# EAGLE design Sonar_2012_V9 (EAGLE 6.1)
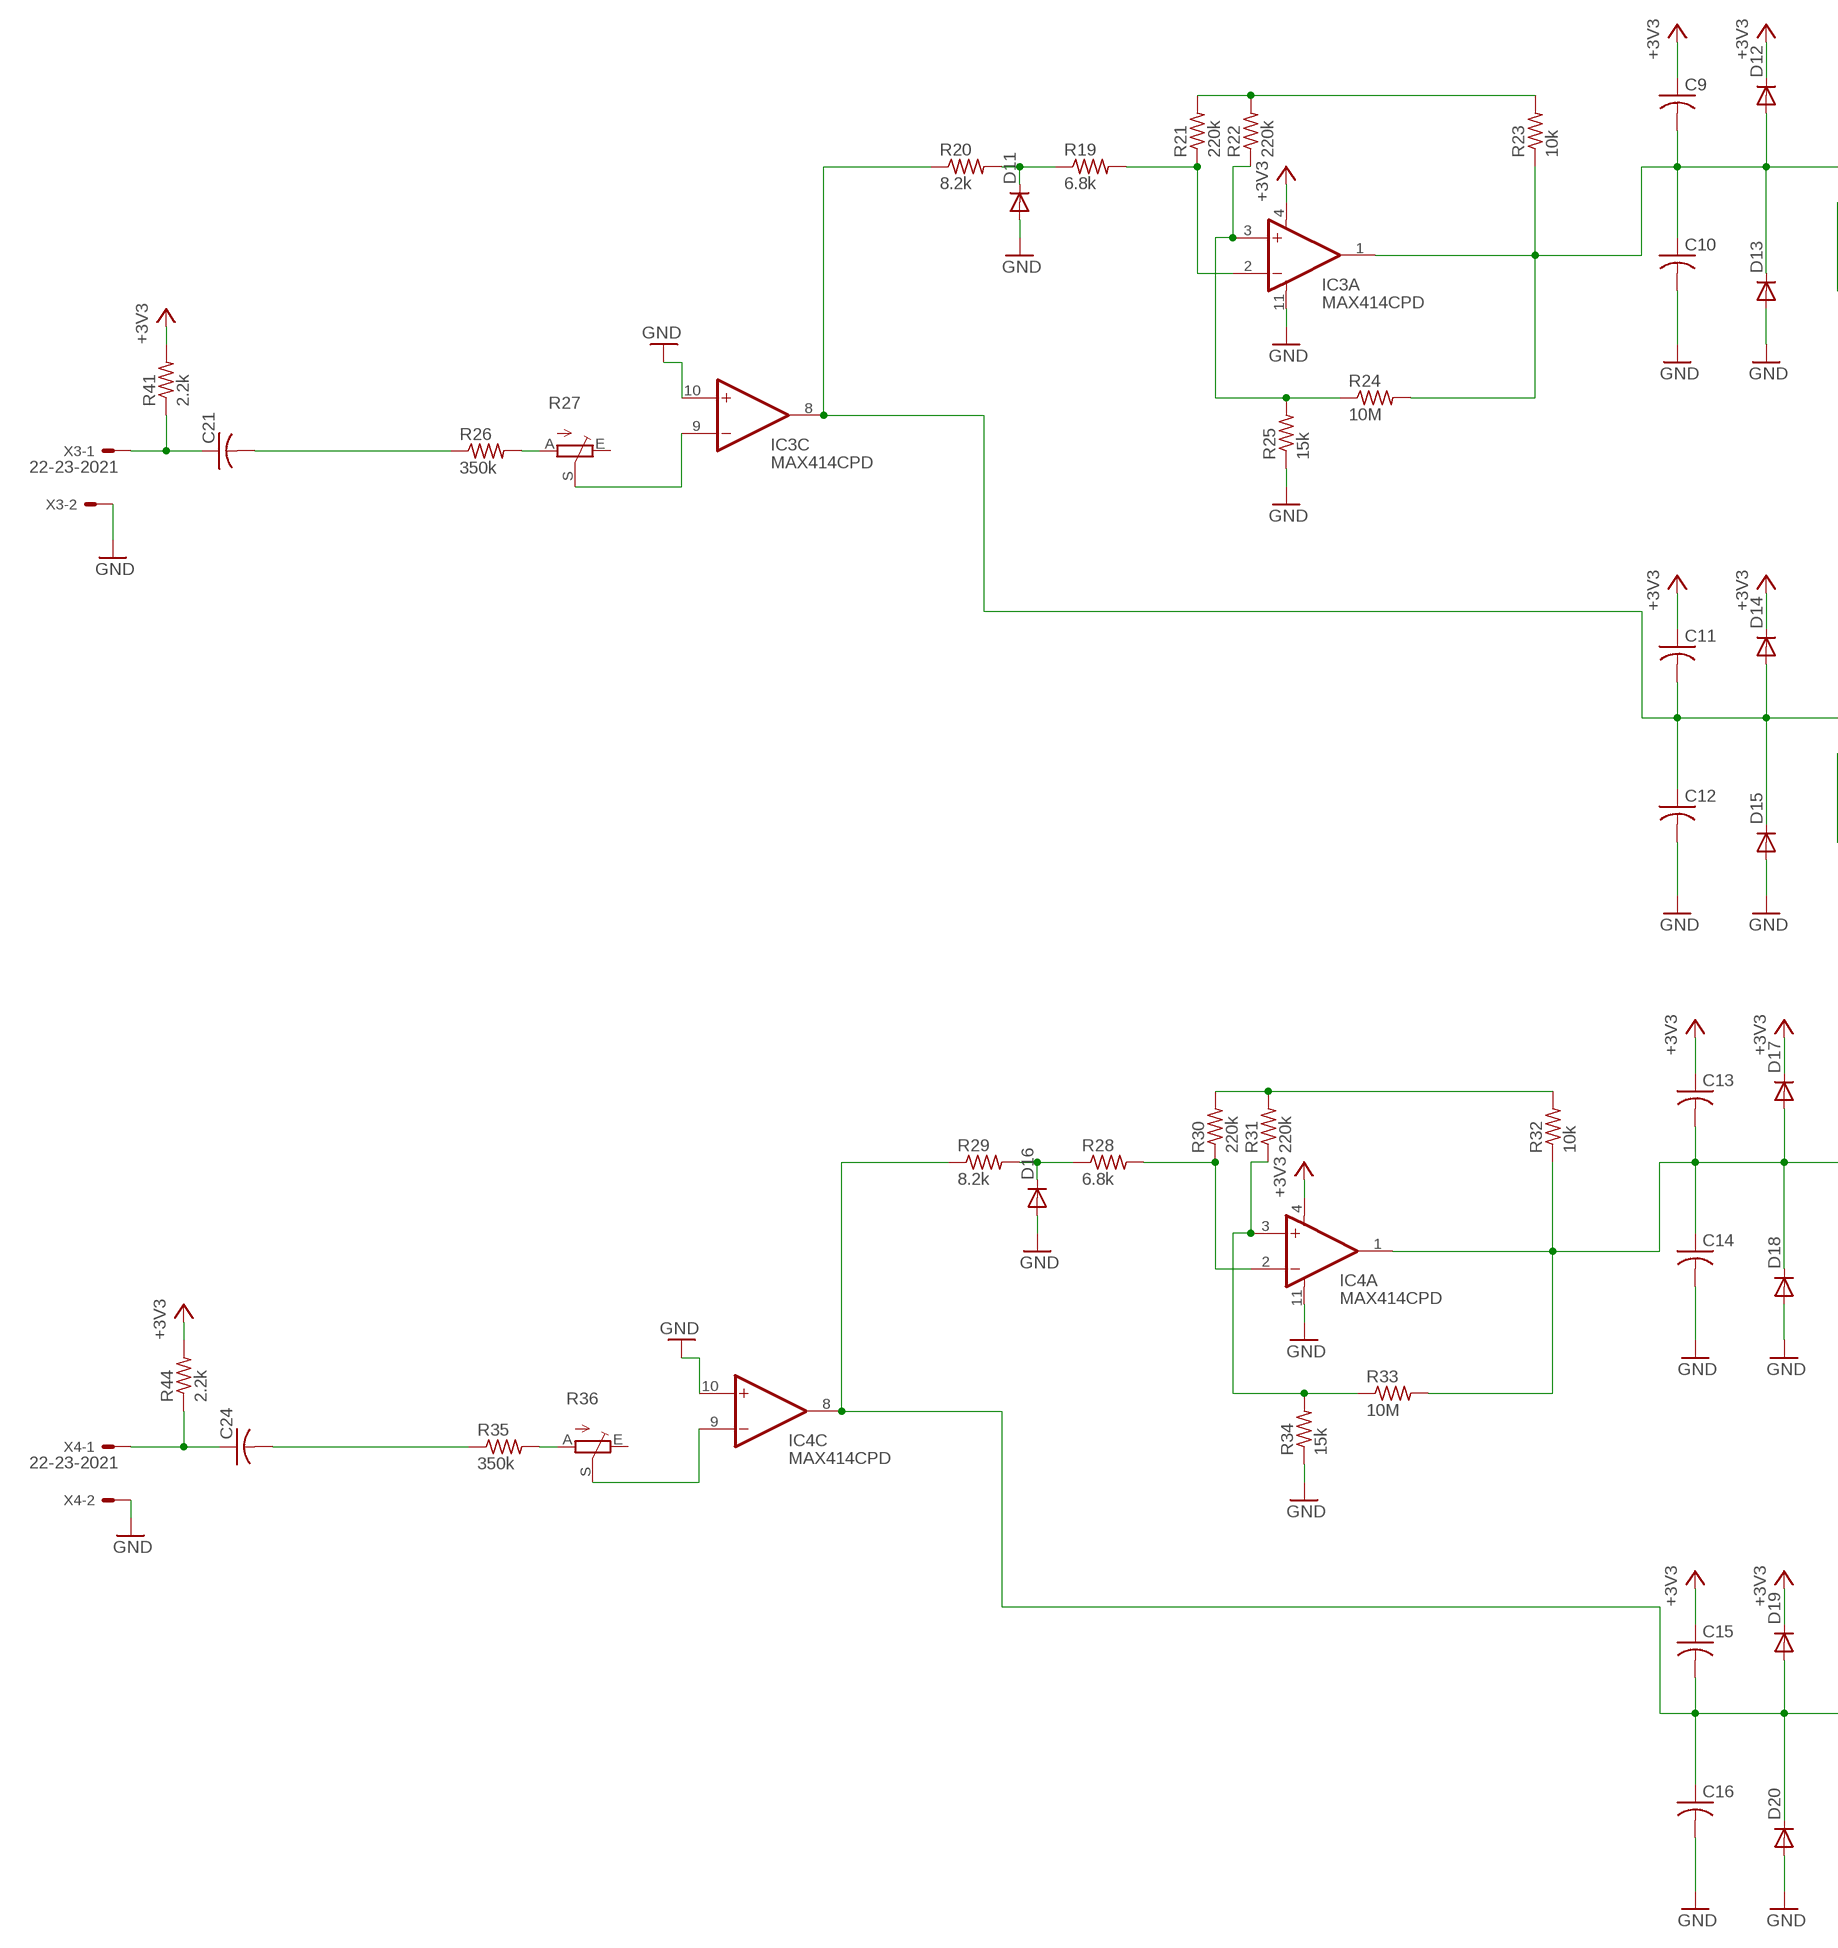
[diagram p0: schematic, sheet 1, part 1 of 2]
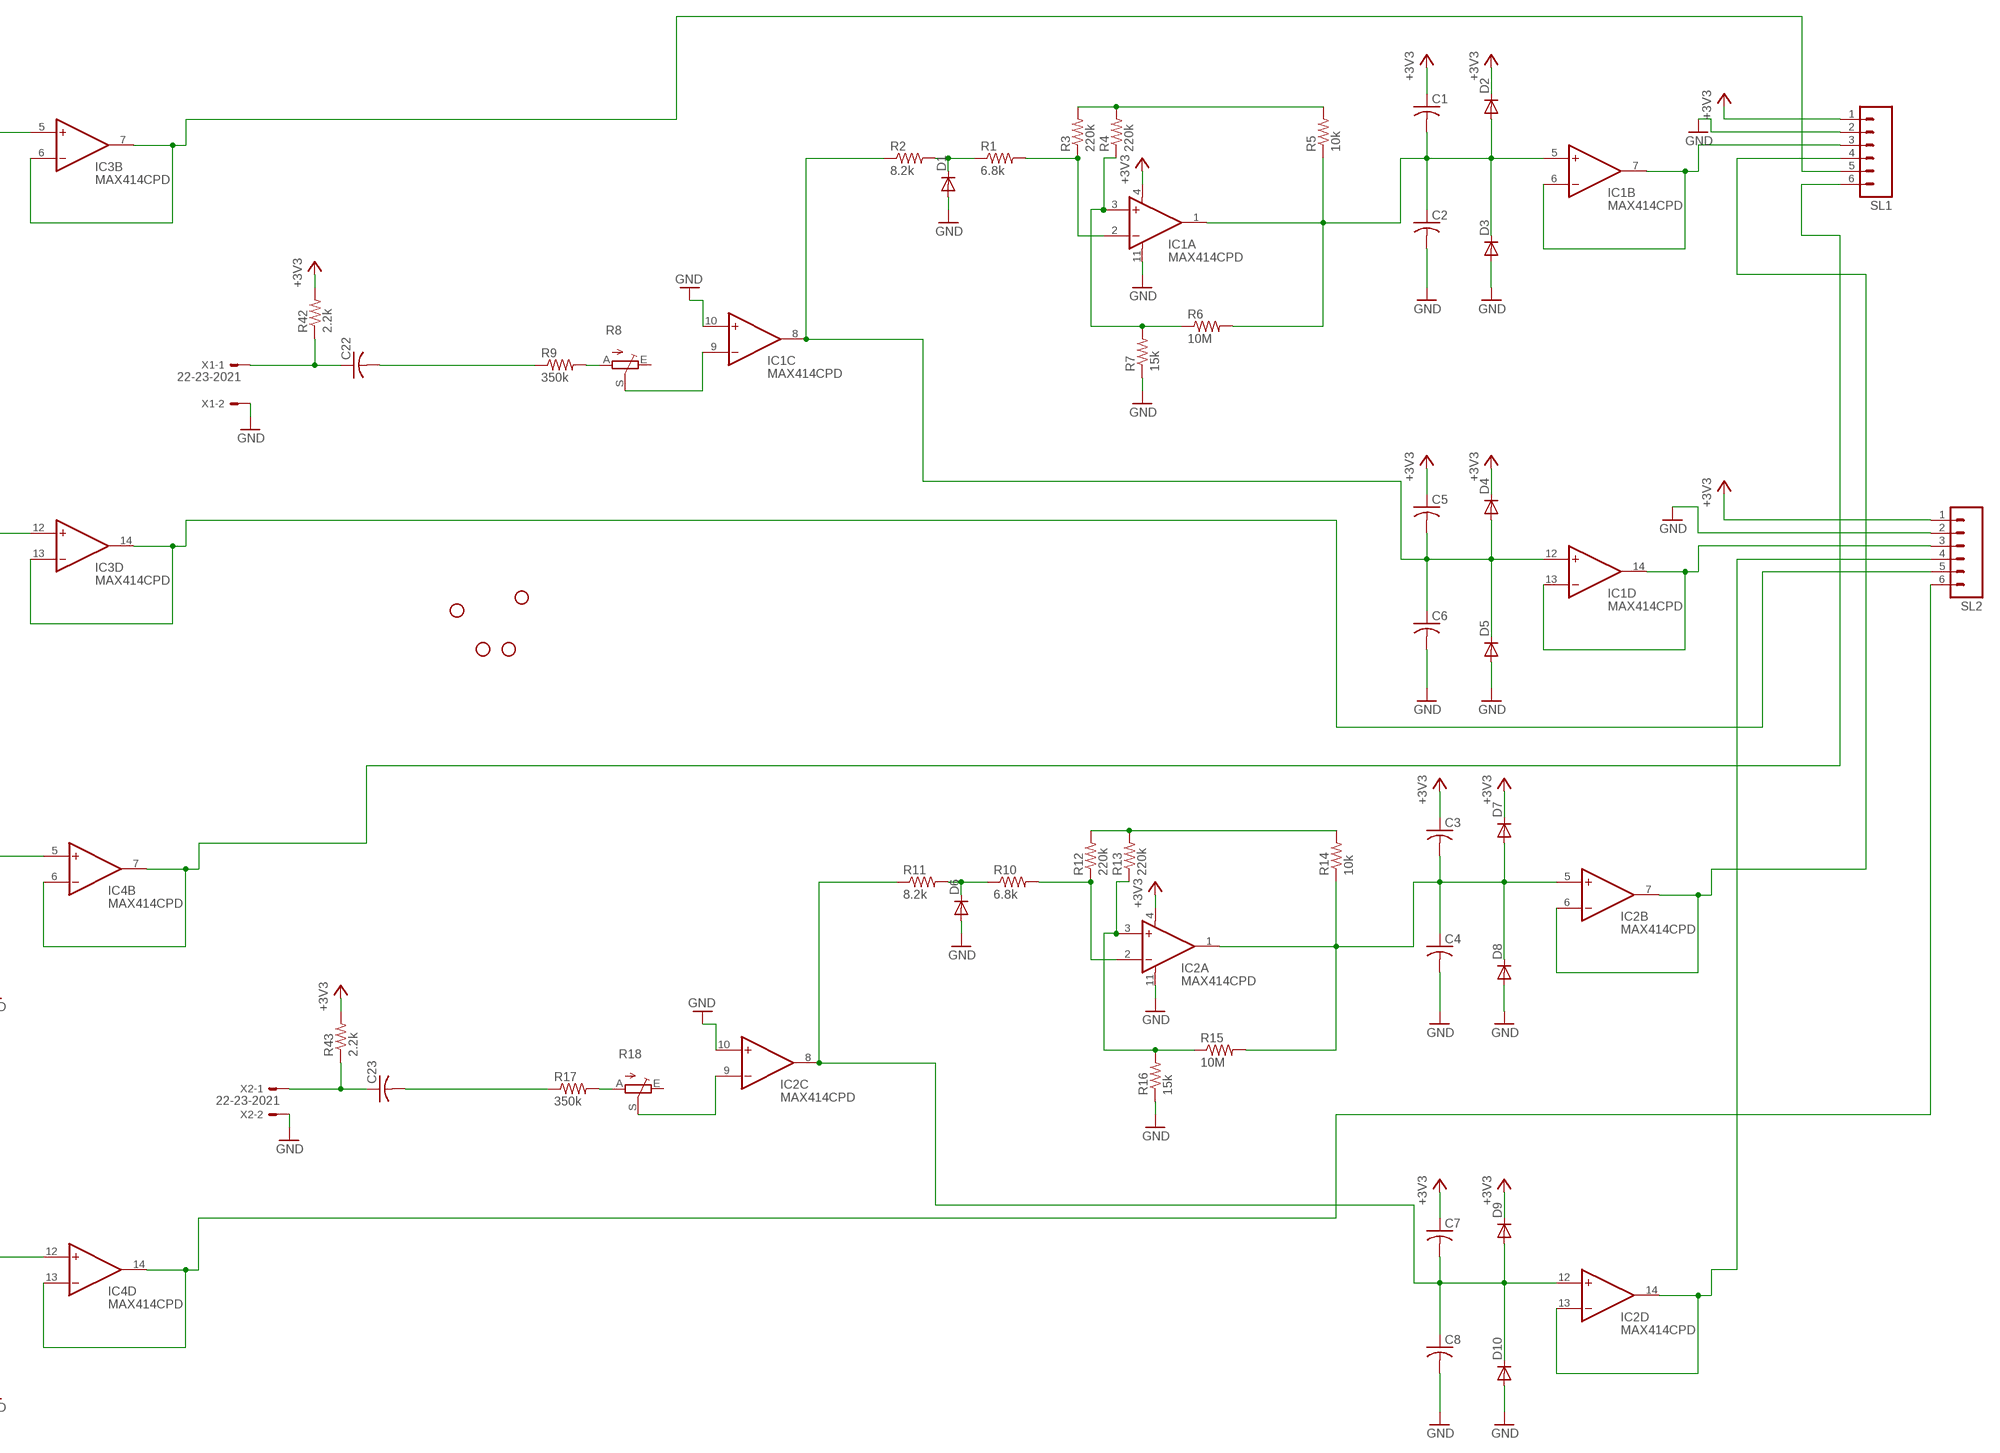
[diagram p1: schematic, sheet 1, part 2 of 2]

## Parts
C1  C-USC0603  [C0603]
C2  C-USC0603  [C0603]
C3  C-USC0603  [C0603]
C4  C-USC0603  [C0603]
C5  C-USC0603  [C0603]
C6  C-USC0603  [C0603]
C7  C-USC0603  [C0603]
C8  C-USC0603  [C0603]
C9  C-USC0603  [C0603]
C10  C-USC0603  [C0603]
C11  C-USC0603  [C0603]
C12  C-USC0603  [C0603]
C13  C-USC0603  [C0603]
C14  C-USC0603  [C0603]
C15  C-USC0603  [C0603]
C16  C-USC0603  [C0603]
C21  C-USC0603  [C0603]
C22  C-USC0603  [C0603]
C23  C-USC0603  [C0603]
C24  C-USC0603  [C0603]
D1  DIODE-SOD523  [SOD523]
D2  DIODE-SOD523  [SOD523]
D3  DIODE-SOD523  [SOD523]
D4  DIODE-SOD523  [SOD523]
D5  DIODE-SOD523  [SOD523]
D6  DIODE-SOD523  [SOD523]
D7  DIODE-SOD523  [SOD523]
D8  DIODE-SOD523  [SOD523]
D9  DIODE-SOD523  [SOD523]
D10  DIODE-SOD523  [SOD523]
D11  DIODE-SOD523  [SOD523]
D12  DIODE-SOD523  [SOD523]
D13  DIODE-SOD523  [SOD523]
D14  DIODE-SOD523  [SOD523]
D15  DIODE-SOD523  [SOD523]
D16  DIODE-SOD523  [SOD523]
D17  DIODE-SOD523  [SOD523]
D18  DIODE-SOD523  [SOD523]
D19  DIODE-SOD523  [SOD523]
D20  DIODE-SOD523  [SOD523]
IC1  MAX414CPD  [DIL14]
IC2  MAX414CPD  [DIL14]
IC3  MAX414CPD  [DIL14]
IC4  MAX414CPD  [DIL14]
JP1  STAND-OFF  [STAND-OFF]
JP2  STAND-OFF  [STAND-OFF]
JP3  STAND-OFF  [STAND-OFF]
JP4  STAND-OFF  [STAND-OFF]
R1  6.8k  R-US_M1206  [M1206]
R2  8.2k  R-US_M1206  [M1206]
R3  220k  R-US_M1206  [M1206]
R4  220k  R-US_M1206  [M1206]
R5  10k  R-US_M1206  [M1206]
R6  10M  R-US_M1206  [M1206]
R7  15k  R-US_M1206  [M1206]
R8  TRIM_EU-B64Y  [B64Y]
R9  350k  R-US_M1206  [M1206]
R10  6.8k  R-US_M1206  [M1206]
R11  8.2k  R-US_M1206  [M1206]
R12  220k  R-US_M1206  [M1206]
R13  220k  R-US_M1206  [M1206]
R14  10k  R-US_M1206  [M1206]
R15  10M  R-US_M1206  [M1206]
R16  15k  R-US_M1206  [M1206]
R17  350k  R-US_M1206  [M1206]
R18  TRIM_EU-B64Y  [B64Y]
R19  6.8k  R-US_M1206  [M1206]
R20  8.2k  R-US_M1206  [M1206]
R21  220k  R-US_M1206  [M1206]
R22  220k  R-US_M1206  [M1206]
R23  10k  R-US_M1206  [M1206]
R24  10M  R-US_M1206  [M1206]
R25  15k  R-US_M1206  [M1206]
R26  350k  R-US_M1206  [M1206]
R27  TRIM_EU-B64Y  [B64Y]
R28  6.8k  R-US_M1206  [M1206]
R29  8.2k  R-US_M1206  [M1206]
R30  220k  R-US_M1206  [M1206]
R31  220k  R-US_M1206  [M1206]
R32  10k  R-US_M1206  [M1206]
R33  10M  R-US_M1206  [M1206]
R34  15k  R-US_M1206  [M1206]
R35  350k  R-US_M1206  [M1206]
R36  TRIM_EU-B64Y  [B64Y]
R41  2.2k  R-US_M1206  [M1206]
R42  2.2k  R-US_M1206  [M1206]
R43  2.2k  R-US_M1206  [M1206]
R44  2.2k  R-US_M1206  [M1206]
SL1  M06  [06P]
SL2  M06  [06P]
X1  22-23-2021  [22-23-2021]
X2  22-23-2021  [22-23-2021]
X3  22-23-2021  [22-23-2021]
X4  22-23-2021  [22-23-2021]

## Nets
+3V3: C1.1 C3.1 C5.1 C7.1 C9.1 C11.1 C13.1 C15.1 D2.C D4.C D7.C D9.C D12.C D14.C D17.C D19.C IC1.4(A:V+) IC2.4(A:V+) IC3.4(A:V+) IC4.4(A:V+) R41.2 R42.2 R43.2 R44.2 SL1.1 SL2.1
GND: C2.2 C4.2 C6.2 C8.2 C10.2 C12.2 C14.2 C16.2 D1.A D3.A D5.A D6.A D8.A D10.A D11.A D13.A D15.A D16.A D18.A D20.A IC1.10(C:+IN) IC1.11(A:V-) IC2.10(C:+IN) IC2.11(A:V-) IC3.10(C:+IN) IC3.11(A:V-) IC4.10(C:+IN) IC4.11(A:V-) R7.1 R16.1 R25.1 R34.1 SL1.2 SL2.2 X1.2 X2.2 X3.2 X4.2
N$1: D1.C R1.1 R2.2
N$2: IC1.2(A:-IN) R1.2 R3.1
N$3: R3.2 R4.2 R5.2
N$4: IC1.3(A:+IN) R4.1 R6.1 R7.2
N$5: C1.2 C2.1 D2.A D3.C IC1.1(A:OUT) IC1.5(B:+IN) R5.1 R6.2
N$6: IC2.2(A:-IN) R10.2 R12.1
N$7: R12.2 R13.2 R14.2
N$8: IC1.6(B:-IN) IC1.7(B:OUT) SL1.3
N$9: D6.C R10.1 R11.2
N$10: IC1.9(C:-IN) R8.S
N$11: C3.2 C4.1 D7.A D8.C IC2.1(A:OUT) IC2.5(B:+IN) R14.1 R15.2
N$12: IC1.13(D:-IN) IC1.14(D:OUT) SL2.3
N$13: IC2.6(B:-IN) IC2.7(B:OUT) SL1.4
N$14: C22.2 R9.1
N$15: R8.A R9.2
N$16: IC2.13(D:-IN) IC2.14(D:OUT) SL2.4
N$17: C5.2 C6.1 D4.A D5.C IC1.8(C:OUT) IC1.12(D:+IN) R2.1
N$18: IC2.9(C:-IN) R18.S
N$19: C23.1 R43.1 X2.1
N$20: R17.2 R18.A
N$21: C7.2 C8.1 D9.A D10.C IC2.8(C:OUT) IC2.12(D:+IN) R11.1
N$22: IC2.3(A:+IN) R13.1 R15.1 R16.2
N$23: IC3.2(A:-IN) R19.2 R21.1
N$24: R21.2 R22.2 R23.2
N$25: D11.C R19.1 R20.2
N$26: C9.2 C10.1 D12.A D13.C IC3.1(A:OUT) IC3.5(B:+IN) R23.1 R24.2
N$27: IC3.6(B:-IN) IC3.7(B:OUT) SL1.5
N$28: IC3.13(D:-IN) IC3.14(D:OUT) SL2.5
N$29: IC3.9(C:-IN) R27.S
N$30: C21.1 R41.1 X3.1
N$31: R26.2 R27.A
N$32: C11.2 C12.1 D14.A D15.C IC3.8(C:OUT) IC3.12(D:+IN) R20.1
N$33: IC3.3(A:+IN) R22.1 R24.1 R25.2
N$34: IC4.2(A:-IN) R28.2 R30.1
N$35: R30.2 R31.2 R32.2
N$36: D16.C R28.1 R29.2
N$37: C13.2 C14.1 D17.A D18.C IC4.1(A:OUT) IC4.5(B:+IN) R32.1 R33.2
N$38: IC4.6(B:-IN) IC4.7(B:OUT) SL1.6
N$39: IC4.13(D:-IN) IC4.14(D:OUT) SL2.6
N$40: IC4.9(C:-IN) R36.S
N$41: C24.1 R44.1 X4.1
N$42: R35.2 R36.A
N$43: C15.2 C16.1 D19.A D20.C IC4.8(C:OUT) IC4.12(D:+IN) R29.1
N$44: IC4.3(A:+IN) R31.1 R33.1 R34.2
N$45: C21.2 R26.1
N$47: C22.1 R42.1 X1.1
N$49: C23.2 R17.1
N$51: C24.2 R35.1
Unconnected: R8.E R18.E R27.E R36.E

## Library data of the parts
C1-C16 C21-C24 = resistor:C-US: CAPACITOR, American symbol
D1-D20 = diode:DIODE-: DIODE
IC1-IC4 = maxim:MAX414CPD: OP AMP; MPN: MAX414CPD+; OC_FARNELL: unknown; OC_NEWARK: 18M7422
JP1-JP4 = ARVP-firby:STAND-OFF: Stand Off This is the mechanical footprint for a #4 phillips button head screw. Use the keepout ring to avoid running the screw head into surrounding components. SKU : PRT-00447
R1-R7 R9-R17 R19-R26 R28-R35 R41-R44 = rcl:R-US_: RESISTOR, American symbol
R8 R18 R27 R36 = pot:TRIM_EU-: POTENTIOMETER
SL1 SL2 = con-amp-quick:M06: AMP QUICK CONNECTOR; OC_FARNELL: unknown; OC_NEWARK: unknown
X1-X4 = con-molex:22-23-2021: .100" (2.54mm) Center Header - 2 Pin; MF: MOLEX; MPN: 22-23-2021; OC_FARNELL: 1462926; OC_NEWARK: 25C3832

## Board
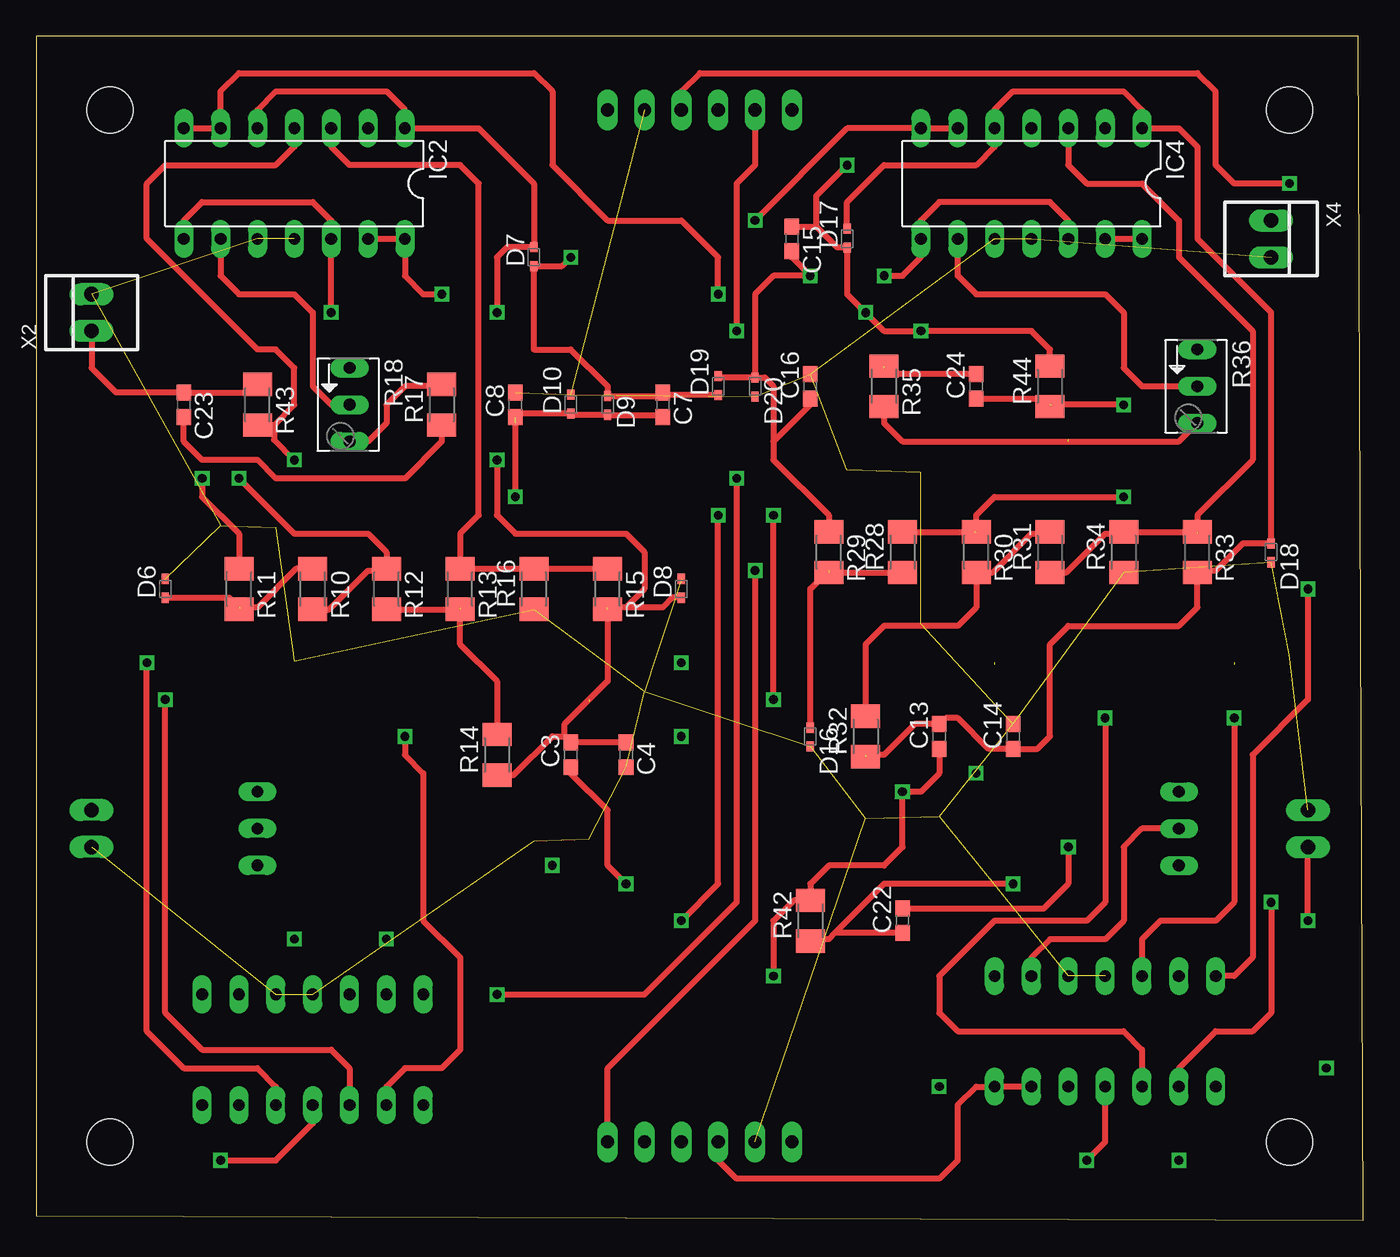
[diagram p2: board, top side]
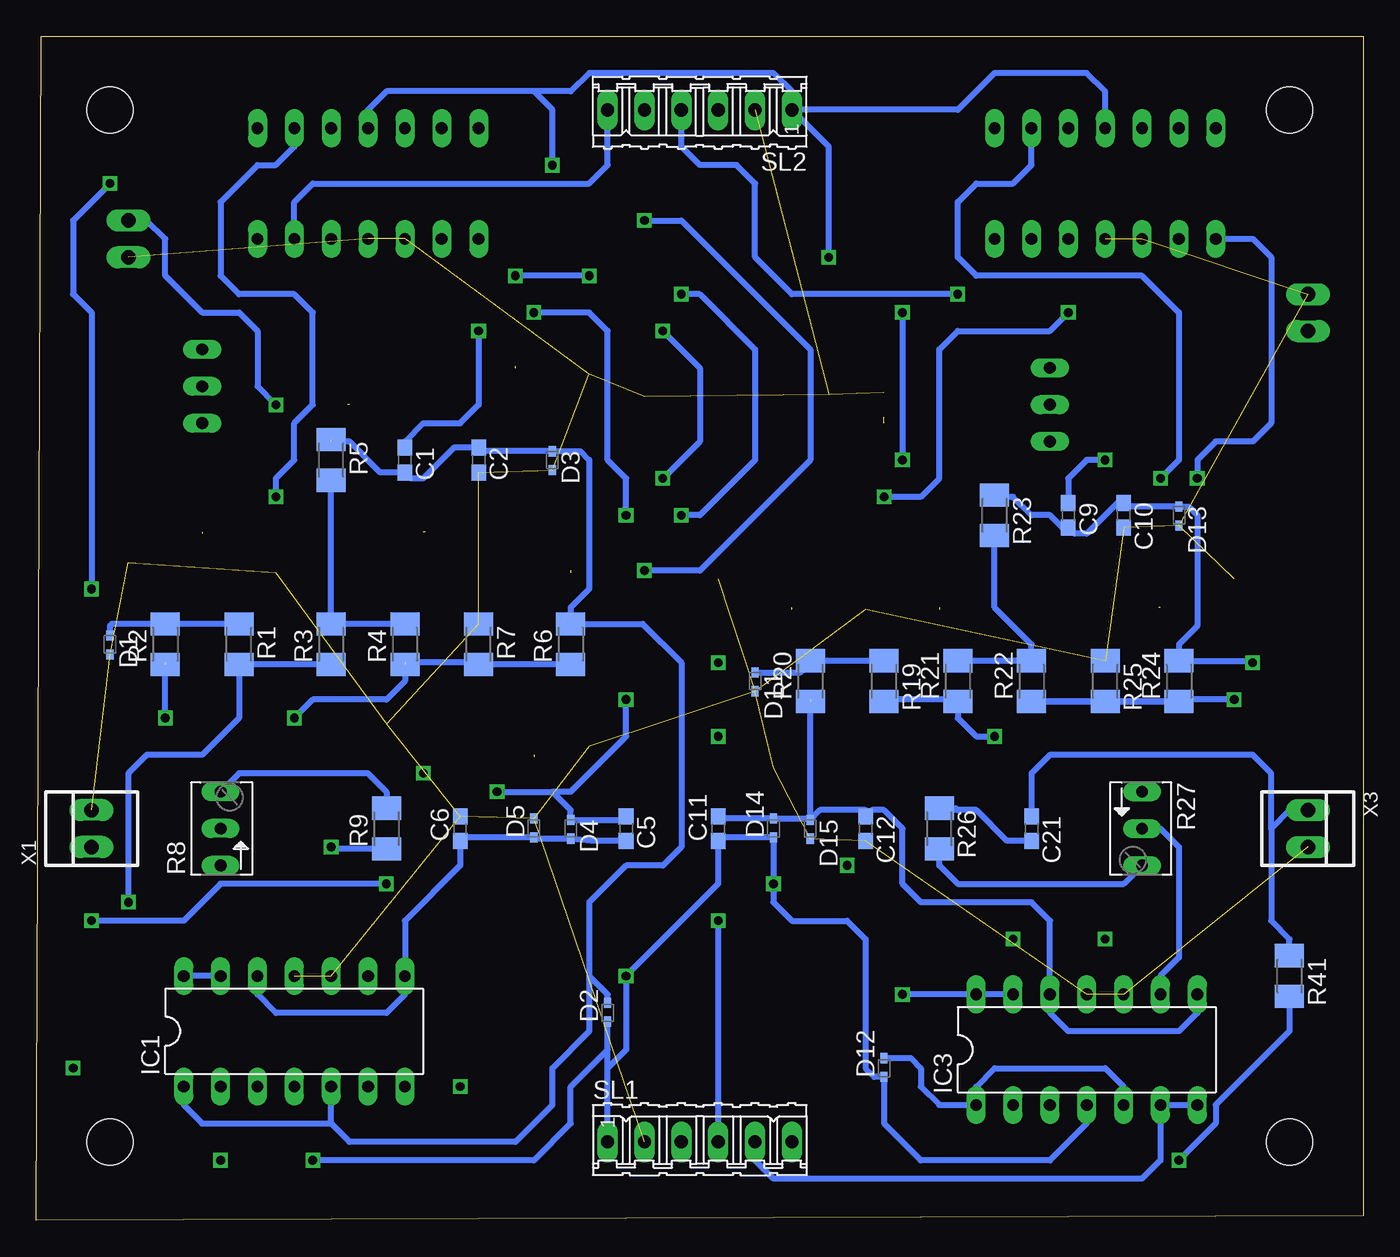
[diagram p3: board, bottom side, seen from below]

Size 91.44 x 81.6 mm. Coordinates in mm from the lower left corner, seen from the top.
Outline: 0,0.33 91.44,0 91.11,81.6 0,81.6 0,0.33
Copper layers (1*16): Top 0.035mm / dielectric 1.5mm / Bottom 0.035mm
Design rules: minimum track width 10mil, minimum drill 24mil, track to track 8mil, track to pad 8mil, pad to pad 8mil, via to via 8mil, smd to smd 8mil, copper to edge 40mil, drill to drill 8mil, minimum pad ring 10mil, minimum via ring 8mil, stop-mask expansion 4mil, vias tented up to drill 0mil, thermal gap 10mil

### Footprints (pad centres in the part's own frame; a part is rotated, then mirrored left to right if it is on the bottom)
C0603 = smd 1.1 x 1: 1 -0.85,0; 2 0.85,0
SOD523 = smd 0.7 x 0.5: A 0.7,0; C -0.6,0
DIL14 = drill 0.813 long: 1 -7.62,-3.81; 2 -5.08,-3.81; 3 -2.54,-3.81; 4 0,-3.81; 5 2.54,-3.81; 6 5.08,-3.81; 7 7.62,-3.81; 8 7.62,3.81; 9 5.08,3.81; 10 2.54,3.81; 11 0,3.81; 12 -2.54,3.81; 13 -5.08,3.81; 14 -7.62,3.81
STAND-OFF = hole 3.175: 0,0
M1206 = smd 1.6 x 2: 1 -1.4,0; 2 1.4,0
B64Y = drill 0.813 long: A 2.54,0; E -2.54,0; S 0,0
06P = drill 0.914 long: 1 -6.35,0; 2 -3.81,0; 3 -1.27,0; 4 1.27,0; 5 3.81,0; 6 6.35,0
22-23-2021 = drill 1 long: 1 -1.27,0; 2 1.27,0

### Placement (x,y rotation side)
C1  66.04,52.4 270 bottom
C2  60.96,52.4 270 bottom
C3  36.83,32.08 90 top
C4  40.64,32.08 270 top
C5  50.8,27 270 bottom
C6  62.23,27 90 bottom
C7  43.18,56.21 270 top
C8  33.02,56.21 90 top
C9  20.32,48.59 270 bottom
C10  16.51,48.59 270 bottom
C11  44.45,27 90 bottom
C12  34.29,27 270 bottom
C13  62.23,33.35 90 top
C14  67.31,33.35 90 top
C15  52.07,67.64 270 top
C16  53.34,57.48 90 top
C21  22.86,27 270 bottom
C22  59.69,20.65 90 top
C23  10.16,56.21 270 top
C24  64.77,57.48 90 top
D1  86.36,39.7 270 bottom
D2  52.07,14.3 90 bottom
D3  55.88,52.4 270 bottom
D4  54.61,27 270 bottom
D5  57.15,27 90 bottom
D6  8.89,43.51 90 top
D7  34.29,66.37 90 top
D8  44.45,43.51 90 top
D9  39.37,56.21 270 top
D10  36.83,56.21 90 top
D11  41.91,37.16 270 bottom
D12  33.02,10.49 90 bottom
D13  12.7,48.59 270 bottom
D14  40.64,27 90 bottom
D15  38.1,27 270 bottom
D16  53.34,33.35 270 top
D17  55.88,67.64 90 top
D18  85.09,46.05 270 top
D19  46.99,57.48 90 top
D20  49.53,57.48 270 top
IC1  73.66,13.03 0 bottom
IC2  17.78,71.45 180 top
IC3  19.05,11.76 0 bottom
IC4  68.58,71.45 180 top
JP1  86.36,76.53 90 top
JP2  5.08,76.53 90 top
JP3  5.08,5.41 90 top
JP4  86.36,5.41 90 top
R1  77.47,39.7 270 bottom
R2  82.55,39.7 90 bottom
R3  71.12,39.7 90 bottom
R4  66.04,39.7 90 bottom
R5  71.12,52.4 270 bottom
R6  54.61,39.7 90 bottom
R7  60.96,39.7 270 bottom
R8  78.74,27 90 bottom
R9  67.31,27 90 bottom
R10  19.05,43.51 270 top
R11  13.97,43.51 270 top
R12  24.13,43.51 270 top
R13  29.21,43.51 270 top
R14  31.75,32.08 90 top
R15  39.37,43.51 270 top
R16  34.29,43.51 90 top
R17  27.94,56.21 90 top
R18  21.59,56.21 270 top
R19  33.02,37.16 270 bottom
R20  38.1,37.16 90 bottom
R21  27.94,37.16 90 bottom
R22  22.86,37.16 90 bottom
R23  25.4,48.59 270 bottom
R24  12.7,37.16 90 bottom
R25  17.78,37.16 270 bottom
R26  29.21,27 270 bottom
R27  15.24,27 270 bottom
R28  59.69,46.05 90 top
R29  54.61,46.05 270 top
R30  64.77,46.05 270 top
R31  69.85,46.05 90 top
R32  57.15,33.35 90 top
R33  80.01,46.05 270 top
R34  74.93,46.05 90 top
R35  58.42,57.48 270 top
R36  80.01,57.48 270 top
R41  5.08,16.84 270 bottom
R42  53.34,20.65 90 top
R43  15.24,56.21 270 top
R44  69.85,57.48 90 top
SL1  45.72,5.41 0 bottom
SL2  45.72,76.53 180 bottom
X1  87.63,27 90 bottom
X2  3.81,62.56 90 top
X3  3.81,27 270 bottom
X4  85.09,67.64 270 top

### Tracks (layer width: path | path; a pad name or v marks a point on that pad's centre or on a via)
+3V3  (via drill 0.6)
  Top 0.406: C3.1 36.83,30.81 39.37,28.27 39.37,24.46 v40.64,23.19 | v36.83,66.37 36.23,65.77 D7.C 34.29,60.02 36.83,60.02 39.37,57.48 D9.C 42.93,56.81 C7.1 | v72.39,4.14 73.66,5.41 IC1.4 | IC2.4 17.78,73.99 16.51,72.72 8.89,72.72 7.62,71.45 7.62,67.64 15.24,60.02 16.51,60.02 17.78,58.75 17.78,56.21 16.38,54.81 | R43.2 16.38,54.81 | 16.38,54.81 16.38,53.8 v17.78,52.4 | 43.43,56.81 C7.1 | C15.1 53.76,68.49 | 53.76,68.49 55.21,67.04 D17.C 55.88,63.83 v57.15,62.56 58.42,61.29 v60.96,61.29 68.58,61.29 69.85,60.02 R44.2 | 53.76,68.49 53.76,70.6 v55.88,72.72 | C13.1 62.23,30.81 60.96,29.54 v59.69,29.54 59.69,25.73 58.42,24.46 54.61,24.46 53.34,23.19 R42.2 | v50.8,35.89 v50.8,48.59 | v12.7,4.14 16.51,4.14 19.05,6.68 IC3.4 | D19.C 43.36,56.88 C7.1 | R42.2 53.34,21.92 | R42.2 52.2,22.05 50.8,20.65 v50.8,16.84
  Bottom 0.406: IC2.4 17.78,77.8 19.05,79.07 25.4,79.07 27.94,76.53 SL2.1 | IC3.4 19.05,6.68 21.59,4.14 30.48,4.14 33.02,6.68 D12.C 33.69,9.89 34.29,10.49 34.29,19.38 35.56,20.65 39.37,20.65 40.64,21.92 v40.64,23.19 D14.C 44.2,26.4 C11.1 44.45,23.19 v50.8,16.84 50.8,11.76 52.07,10.49 | C5.1 51.05,27.6 D4.C 54.61,28.27 55.88,29.54 | v36.83,66.37 36.83,73.99 SL2.1 | C1.1 66.04,53.67 64.77,54.94 62.23,54.94 60.96,56.21 v60.96,61.29 | v72.39,4.14 57.15,4.14 54.61,6.68 54.61,9.22 52.07,11.76 | 57.15,77.8 54.61,77.8 53.34,79.07 40.64,79.07 39.37,77.8 SL2.1 | 57.15,77.8 67.31,77.8 68.58,76.53 IC4.4 | v17.78,52.4 19.05,52.4 20.32,51.13 C9.1 | v55.88,72.72 55.88,76.53 57.15,77.8 | R41.2 5.08,13.03 10.16,7.95 10.16,6.68 v12.7,4.14 | SL1.1 52.07,10.49 | 52.07,10.49 52.07,11.76 | 52.07,11.76 D2.C | v59.69,29.54 55.88,29.54 | v50.8,35.89 50.8,33.35 54.61,29.54 55.88,29.54 | v50.8,48.59 50.8,51.13 52.07,52.4 52.07,61.29 53.34,62.56 v57.15,62.56
GND  (37 unrouted)
N$1
  Bottom 0.406: R1.1 R2.2 86.23,41.1 86.36,40.97 D1.C
N$2  (via drill 0.6)
  Top 0.406: IC1.2 78.74,10.49 81.28,13.03 83.82,13.03 85.09,14.3 v85.09,21.92
  Bottom 0.406: R3.1 R1.2 77.47,34.62 80.01,32.08 83.82,32.08 85.09,30.81 v85.09,21.92
N$3
  Bottom 0.406: R4.2 R3.2 R5.2
N$4  (via drill 0.6)  (1 unrouted)
  Top 0.406: IC1.3 76.2,11.76 74.93,13.03 63.5,13.03 62.23,14.3 62.23,16.84 66.04,20.65 72.39,20.65 73.66,21.92 v73.66,34.62
  Bottom 0.406: R6.1 60.83,38.3 60.96,38.43 | 60.96,38.43 66.04,38.43 66.04,37.16 67.31,35.89 72.39,35.89 v73.66,34.62 | R7.2 60.96,38.43
N$5  (1 unrouted)
  Bottom 0.406: 70.57,53.25 R5.1 | 71.12,53.67 69.85,53.67 67.73,51.55 C1.2 65.62,51.13 64.77,51.13 62.65,53.25 C2.1 60.71,53 D3.C 53.94,53 53.34,52.4 53.34,43.51 54.61,42.24 R6.2 49.66,41.1 46.99,38.43 46.99,25.73 48.26,24.46 50.8,24.46 53.34,21.92 53.34,16.84 | 71.12,6.68 69.85,5.41 58.42,5.41 55.88,7.95 55.88,10.49 53.34,13.03 53.34,16.84 | 71.12,6.68 IC1.5 | IC1.1 81.28,7.95 80.01,6.68 71.12,6.68 | D2.A 52.07,15.57 53.34,16.84
N$6  (via drill 0.6)
  Top 0.406: R12.1 24.13,44.78 | R10.2 20.19,42.11 22.86,44.78 24,44.78 R12.1 | v13.97,51.13 17.78,47.32 22.86,47.32 24.13,46.05 R12.1
  Bottom 0.406: IC2.2 22.86,72.72 24.13,71.45 26.67,71.45 27.94,70.18 27.94,66.37 26.67,65.1 15.24,65.1 12.7,62.56 12.7,52.4 v13.97,51.13
N$7  (1 unrouted)
  Top 0.406: R12.2 R13.2 | R14.2 31.75,37.16 29.21,39.7 29.21,42.24
N$8
  Top 0.406: IC1.6 IC1.7 64.77,9.22 63.5,7.95 63.5,4.14 62.23,2.87 48.26,2.87 46.99,4.14 SL1.3
N$9  (1 unrouted)
  Top 0.406: R10.1 17.91,44.91 15.24,42.24 14.1,42.24 R11.2 | D6.C 13.3,42.91 13.97,42.24
N$10
  Top 0.406: R8.S 76.2,27 74.93,25.73 74.93,20.65 73.66,19.38 69.85,19.38 68.58,18.11 IC1.9
N$11  (via drill 0.6)  (1 unrouted)
  Top 0.406: R14.1 32.89,30.68 35.56,33.35 36.41,33.35 | 36.41,33.35 C3.2 C4.1 | IC2.5 15.24,76.53 16.51,77.8 24.13,77.8 25.4,76.53 IC2.1 30.48,75.26 34.29,71.45 D7.A 32.45,67.07 31.75,66.37 v31.75,62.56 | 40.64,42.24 41.91,43.51 41.91,46.05 40.64,47.32 33.02,47.32 31.75,48.59 v31.75,52.4 | 40.64,42.24 39.37,42.24 | D8.C 43.85,42.91 43.18,42.24 40.64,42.24 | R15.2 39.37,37.16 36.41,34.2 36.41,33.35
  Bottom 0.406: v31.75,62.56 v31.75,52.4
N$12  (via drill 0.6)
  Top 0.406: v86.36,71.45 82.55,71.45 81.28,72.72 81.28,77.8 80.01,79.07 45.72,79.07 44.45,77.8 SL2.3 | v87.63,43.51 87.63,35.89 83.82,32.08 83.82,18.11 82.55,16.84 IC1.14
  Bottom 0.406: IC1.13 IC1.14 | v86.36,71.45 88.9,68.91 88.9,63.83 87.63,62.56 v87.63,43.51
N$13  (via drill 0.6)
  Top 0.406: IC2.7 IC2.6 12.7,77.8 13.97,79.07 34.29,79.07 35.56,77.8 35.56,72.72 39.37,68.91 44.45,68.91 46.99,66.37 v46.99,63.83 | v44.45,20.65 46.99,23.19 v46.99,48.59
  Bottom 0.406: v46.99,63.83 45.72,63.83 41.91,60.02 41.91,52.4 45.72,48.59 v46.99,48.59 | v44.45,20.65 SL1.4
N$14  (via drill 0.6)
  Top 0.406: v71.12,25.73 71.12,23.19 69.43,21.5 C22.2
  Bottom 0.406: R9.1 70.99,25.6 v71.12,25.73
N$15
  Bottom 0.406: 67.31,28.27 R9.2 67.31,29.54 68.58,30.81 77.47,30.81 R8.A
N$16  (via drill 0.6)
  Top 0.406: IC2.13 IC2.14 25.4,65.1 26.67,63.83 v27.94,63.83
  Bottom 0.406: v27.94,63.83 39.37,63.83 41.91,66.37 41.91,71.45 43.18,72.72 45.72,72.72 46.99,73.99 SL2.4
N$17  (via drill 0.6)  (1 unrouted)
  Top 0.406: IC1.12 76.2,19.38 77.47,20.65 81.28,20.65 82.55,21.92 v82.55,34.62
  Bottom 0.406: v82.55,34.62 82.55,38.43 | IC1.12 76.2,15.57 74.93,14.3 67.31,14.3 66.04,15.57 IC1.8 66.04,20.65 62.23,24.46 C6.1 61.98,26.4 D5.C 57.05,26.3 D4.A 53.19,26.15 C5.2
N$18
  Top 0.406: IC2.9 12.7,65.1 13.97,63.83 17.78,63.83 19.05,62.56 19.05,57.48 20.32,56.21 R18.S
N$19
  Top 0.406: X2.1 3.81,58.75 5.5,57.06 C23.1 14.69,57.06 R43.1
N$20
  Top 0.406: R17.2 27.94,57.48 25.4,57.48 24.13,56.21 24.13,54.94 22.86,53.67 R18.A
N$21  (via drill 0.6)  (1 unrouted)
  Top 0.406: v20.32,62.56 IC2.12 20.32,68.91 19.05,70.18 11.43,70.18 10.16,68.91 IC2.8 | v11.43,51.13 11.43,49.86 13.97,47.32 R11.1 | C8.1 33.27,55.61 D10.C 36.93,55.51 D9.A 43.03,55.51 C7.2 | v33.02,49.86 33.02,54.94
  Bottom 0.406: v20.32,62.56 21.59,61.29 27.94,61.29 29.21,60.02 29.21,51.13 30.48,49.86 v33.02,49.86 | IC2.8 7.62,67.64 6.35,66.37 6.35,54.94 7.62,53.67 10.16,53.67 11.43,52.4 v11.43,51.13
N$22
  Top 0.406: R15.1 R16.2 R13.1 29.21,47.32 30.48,48.59 30.48,71.45 29.21,72.72 21.59,72.72 20.32,73.99 IC2.3
N$23  (via drill 0.6)
  Top 0.406: v25.4,33.35 25.4,32.08 26.67,30.81 26.67,20.65 29.21,18.11 29.21,11.76 27.94,10.49 25.4,10.49 24.13,9.22 IC3.2
  Bottom 0.406: R19.2 32.89,35.89 27.94,35.89 R21.1 27.94,34.62 26.67,33.35 v25.4,33.35
N$24
  Bottom 0.406: R21.2 R22.2 22.86,39.7 25.4,42.24 R23.2
N$25
  Bottom 0.406: R19.1 R20.2 38.1,38.43 38.77,37.76 D11.C
N$26  (via drill 0.6)
  Top 0.406: IC3.5 16.51,9.22 15.24,10.49 10.16,10.49 7.62,13.03 v7.62,38.43
  Bottom 0.406: R23.1 25.27,49.86 24.13,49.86 22.86,48.59 21.59,48.59 20.74,47.74 C9.2 19.9,47.32 19.05,47.32 16.93,49.44 C10.1 16.26,49.19 D13.C 12.03,49.19 11.43,48.59 11.43,40.97 12.7,39.7 R24.2 | D12.A 31.18,11.19 30.48,10.49 30.48,9.22 29.21,7.95 IC3.1 26.67,9.22 25.4,10.49 17.78,10.49 16.51,9.22 IC3.5 | 12.57,38.43 R24.2 | R24.2 12.7,38.43 | R24.2 7.75,38.56 v7.62,38.43
N$27
  Bottom 0.406: IC3.7 IC3.6 13.97,4.14 15.24,2.87 40.64,2.87 41.91,4.14 SL1.5
N$28  (via drill 0.6)
  Top 0.406: v31.75,15.57 41.91,15.57 48.26,21.92 v48.26,51.13 | SL2.5 49.53,72.72 48.26,71.45 v48.26,61.29
  Bottom 0.406: IC3.13 IC3.14 v31.75,15.57 | v48.26,61.29 45.72,58.75 45.72,53.67 v48.26,51.13
N$29
  Bottom 0.406: IC3.9 13.97,16.84 12.7,18.11 12.7,25.73 13.97,27 R27.S
N$30
  Bottom 0.406: 6.35,27 5.08,28.27 X3.1 | 6.35,27 6.35,20.65 5.08,19.38 R41.1 | 6.35,27 6.35,30.81 7.62,32.08 21.59,32.08 22.86,30.81 C21.1
N$31
  Bottom 0.406: 29.08,25.73 R26.2 29.21,24.46 27.94,23.19 16.51,23.19 R27.A
N$32  (1 unrouted)
  Bottom 0.406: IC3.8 11.43,14.3 12.7,13.03 20.32,13.03 21.59,14.3 IC3.12 21.59,20.65 22.86,21.92 30.48,21.92 31.75,23.19 31.75,27 33.02,28.27 33.87,28.27 C12.1 34.29,28.27 37.43,28.27 D15.C | C11.2 44.3,27.7 D14.A 38.2,27.7 D15.C | D15.C 38.1,35.89
N$33  (via drill 0.6)
  Top 0.406: IC3.3 21.59,10.49 20.32,11.76 11.43,11.76 8.89,14.3 v8.89,35.89
  Bottom 0.406: 17.78,35.89 17.65,35.76 R24.1 R22.1 | R25.2 R22.1 | R22.1 12.83,35.76 12.7,35.89 v8.89,35.89
N$34  (via drill 0.6)  (1 unrouted)
  Top 0.406: R28.2 64.64,47.45 64.77,47.32 | R30.1 64.77,48.59 66.04,49.86 v74.93,49.86
  Bottom 0.406: IC4.2 73.66,73.99 74.93,72.72 76.2,72.72 78.74,70.18 78.74,65.1 77.47,63.83 73.66,63.83 72.39,62.56 72.39,56.21 73.66,54.94 73.66,52.4 74.93,51.13 v74.93,49.86
N$35
  Top 0.406: R31.2 69.72,47.32 68.58,47.32 65.91,44.65 R30.2 64.77,42.24 63.5,40.97 58.42,40.97 57.15,39.7 R32.2
N$36  (1 unrouted)
  Top 0.406: R29.2 R28.1 | D16.C 53.34,43.51 54.61,44.78
N$37  (1 unrouted)
  Top 0.406: 80.14,44.78 R33.2 | 57.7,32.5 R32.1 | R33.2 80.01,42.24 78.74,40.97 71.12,40.97 69.85,39.7 69.85,33.35 69,32.5 C14.1 65.62,32.5 63.5,34.62 62.65,34.62 C13.2 60.54,34.2 58.42,32.08 57.15,32.08 | R33.2 80.01,44.78 80.14,44.78 | D17.A 55.88,70.18 58.42,72.72 64.77,72.72 66.04,73.99 IC4.5 66.04,76.53 67.31,77.8 74.93,77.8 76.2,76.53 IC4.1 78.74,75.26 80.01,73.99 80.01,67.64 85.09,62.56 D18.C 83.15,46.65 81.28,44.78 80.14,44.78
N$38  (via drill 0.6)
  Top 0.406: IC4.6 IC4.7 55.88,75.26 v49.53,68.91 | SL1.6 39.37,10.49 49.53,20.65 v49.53,44.78
  Bottom 0.406: v49.53,68.91 46.99,68.91 38.1,60.02 38.1,52.4 45.72,44.78 v49.53,44.78
N$39
  Top 0.406: IC4.13 IC4.14
  Bottom 0.406: IC4.13 73.66,70.18 72.39,71.45 53.34,71.45 52.07,72.72 SL2.6
N$40
  Top 0.406: IC4.9 63.5,65.1 64.77,63.83 73.66,63.83 74.93,62.56 74.93,58.75 76.2,57.48 R36.S
N$41  (via drill 0.6)  (1 unrouted)
  Top 0.406: C24.1 69.43,56.63 69.85,56.21 | v74.93,56.21 69.98,56.21 R44.1
  Bottom 0.406: X4.1 83.82,68.91 82.55,67.64 82.55,65.1 80.01,62.56 77.47,62.56 76.2,61.29 76.2,57.48 v74.93,56.21
N$42
  Top 0.406: R35.2 58.42,54.94 59.69,53.67 78.74,53.67 R36.A
N$43  (via drill 0.6)
  Top 0.406: R29.1 54.61,48.59 50.8,52.4 50.8,53.67 | IC4.12 71.12,68.91 69.85,70.18 62.23,70.18 60.96,68.91 IC4.8 60.96,66.37 59.69,65.1 v58.42,65.1 | C15.2 52.07,66.37 v53.34,65.1 50.8,65.1 49.53,63.83 D20.C | D20.C 50.2,58.08 50.8,57.48 50.8,53.67 | C16.1 53.34,56.21 50.8,53.67 | D20.C 47.09,58.08 D19.A
  Bottom 0.406: v53.34,65.1 v58.42,65.1
N$44  (1 unrouted)
  Top 0.406: R31.1 70.99,44.65 73.66,47.32 74.8,47.32 R34.2 R33.1 | IC4.3 71.12,72.72 72.39,71.45 76.2,71.45 78.74,68.91 78.74,66.37 83.82,61.29 83.82,52.4 80.01,48.59 80.01,47.32
N$45
  Bottom 0.406: C21.2 24.55,26.15 26.67,28.27 27.94,28.27 | 27.94,28.27 29.21,28.27 | R26.1 28.07,28.4 27.94,28.27
N$47  (via drill 0.6)
  Top 0.406: v87.63,20.65 X1.1 | R42.1 53.47,19.38 54.61,19.38 55.03,19.8 | v67.31,23.19 58.42,23.19 55.03,19.8 | C22.1 55.03,19.8
  Bottom 0.406: v67.31,23.19 78.74,23.19 81.28,20.65 v87.63,20.65
N$49
  Top 0.406: R17.1 27.94,53.67 25.4,51.13 16.51,51.13 15.24,52.4 11.43,52.4 10.16,53.67 C23.2
N$51  (1 unrouted)
  Top 0.406: C24.2 58.42,58.33 58.42,58.75
N$53  (via drill 0.6)
  other vias: 17.78,19.38
N$54  (via drill 0.6)
  other vias: 35.56,24.46
N$56  (via drill 0.6)
  other vias: 44.45,33.35
N$57  (via drill 0.6)
  other vias: 44.45,38.43
N$58  (via drill 0.6)
  other vias: 24.13,19.38
N$63  (via drill 0.6)
  other vias: 78.74,4.14
N$65  (via drill 0.6)
  other vias: 64.77,30.81
N$66  (via drill 0.6)
  other vias: 62.23,9.22
N$67  (via drill 0.6)
  other vias: 88.9,10.49